# Altium schematic sheet 1.SCHDOC
size A4
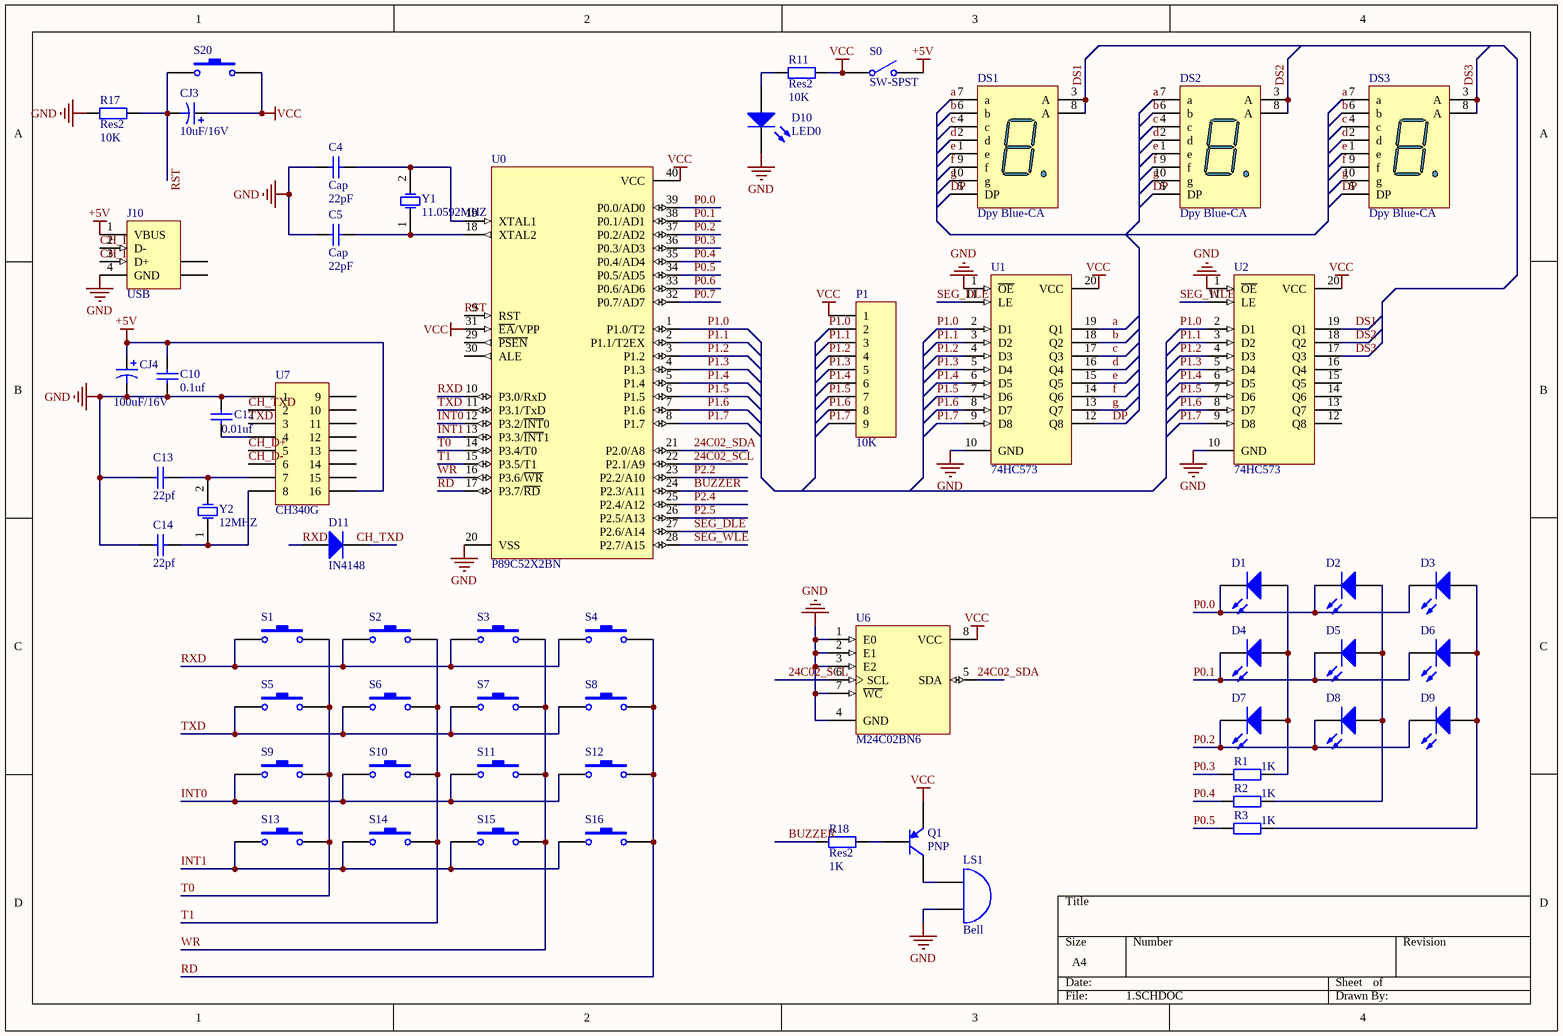
[diagram p0: 1.SCHDOC]

## Parts
C4  Cap  value 22pF  [RAD-0.3]
C5  Cap  value 22pF  [RAD-0.3]
C10  value 0.1uf  [RAD-0.3]  (hidden comment: Cap)
C12  value 0.01uf  [RAD-0.3]  (hidden comment: Cap)
C13  value 22pf  [RAD-0.3]  (hidden comment: Cap)
C14  value 22pf  [RAD-0.3]  (hidden comment: Cap)
CJ3  value 10uF/16V  [RB7.6-15]
CJ4  value 100uF/16V  [RB7.6-15]
D1  (no value)  [LED-0]
D2  (no value)  [LED-0]
D3  (no value)  [LED-0]
D4  (no value)  [LED-0]
D5  (no value)  [LED-0]
D6  (no value)  [LED-0]
D7  (no value)  [LED-0]
D8  (no value)  [LED-0]
D9  (no value)  [LED-0]
D10  LED0  [LED-0]
D11  IN4148  [DO-35]
DS1  Dpy Blue-CA  [H]
DS2  Dpy Blue-CA  [H]
DS3  Dpy Blue-CA  [H]
J10  USB  [787616]
LS1  Bell  [PIN2]
P1  10K  [MHDR1X9]
Q1  PNP  [SOT-23B]
R1  value 1K  [AXIAL-0.4]
R2  value 1K  [AXIAL-0.4]
R3  value 1K  [AXIAL-0.4]
R11  Res2  value 10K  [AXIAL-0.4]
R17  Res2  value 10K  [AXIAL-0.4]
R18  Res2  value 1K  [AXIAL-0.4]
S0  SW-SPST  [SPST-2]
S1  (no value)  [SPST-2]
S2  (no value)  [SPST-2]
S3  (no value)  [SPST-2]
S4  (no value)  [SPST-2]
S5  (no value)  [SPST-2]
S6  (no value)  [SPST-2]
S7  (no value)  [SPST-2]
S8  (no value)  [SPST-2]
S9  (no value)  [SPST-2]
S10  (no value)  [SPST-2]
S11  (no value)  [SPST-2]
S12  (no value)  [SPST-2]
S13  (no value)  [SPST-2]
S14  (no value)  [SPST-2]
S15  (no value)  [SPST-2]
S16  (no value)  [SPST-2]
S20  (no value)  [SPST-2]
U0  P89C52X2BN  [SOT129-1]
U1  74HC573  [FK020]
U2  74HC573  [FK020]
U6  M24C02BN6  [PSDIP8A]
U7  CH340G  [HDR2X8_CEN]
Y1  11.0592MHZ  [R38]
Y2  12MHZ  [R38]

## Nets
+5V: C10.1 CJ4.1 J10.1(VBUS) S0.2(NO) U7.16
GND: C4.1 C5.1 C10.2 C12.2 C13.2 C14.2 CJ4.2 D10.2(K) J10.4(GND) LS1.2(B) R17.1 U0.20(VSS) U1.1(~{OE}) U1.10(GND) U2.1(~{OE}) U2.10(GND) U6.1(E0) U6.2(E1) U6.3(E2) U6.4(GND) U6.7(~{WC}) U7.1
VCC: CJ3.1 P1.1 Q1.3(E) R11.1 S0.1(COMMON) S20.2 U0.31(~{EA}/VPP) U0.40(VCC) U1.20(VCC) U2.20(VCC) U6.8(VCC)
24C02_SCL: U0.22(P2.1/A9) U6.6(SCL)
24C02_SDA: U0.21(P2.0/A8) U6.5(SDA)
a: DS1.7(a) DS2.7(a) DS3.7(a) U1.19(Q1)
b: DS1.6(b) DS2.6(b) DS3.6(b) U1.18(Q2)
BUZZER: R18.2 U0.24(P2.3/A11)
c: DS1.4(c) DS2.4(c) DS3.4(c) U1.17(Q3)
CH_D+: J10.3(D+) U7.5
CH_D-: J10.2(D-) U7.6
CH_TXD: U7.2
d: DS1.2(d) DS2.2(d) DS3.2(d) U1.16(Q4)
DP: DS1.5(DP) DS2.5(DP) DS3.5(DP) U1.12(Q8)
DS1: DS1.3(A) DS1.8(A) U2.19(Q1)
DS2: DS2.3(A) DS2.8(A) U2.18(Q2)
DS3: DS3.3(A) DS3.8(A) U2.17(Q3)
e: DS1.1(e) DS2.1(e) DS3.1(e) U1.15(Q5)
f: DS1.9(f) DS2.9(f) DS3.9(f) U1.14(Q6)
g: DS1.10(g) DS2.10(g) DS3.10(g) U1.13(Q7)
INT0: S9.1 S10.1 S11.1 S12.1 U0.12(P3.2/~{INT}0)
INT1: S13.1 S14.1 S15.1 S16.1 U0.13(P3.3/~{INT}1)
P0.0: D1.2(K) D2.2(K) D3.2(K) U0.39(P0.0/AD0)
P0.1: D4.2(K) D5.2(K) D6.2(K) U0.38(P0.1/AD1)
P0.2: D7.2(K) D8.2(K) D9.2(K) U0.37(P0.2/AD2)
P0.3: R1.2 U0.36(P0.3/AD3)
P0.4: R2.2 U0.35(P0.4/AD4)
P0.5: R3.2 U0.34(P0.5/AD5)
P0.6: U0.33(P0.6/AD6)
P0.7: U0.32(P0.7/AD7)
P1.0: P1.2 U0.1(P1.0/T2) U1.2(D1) U2.2(D1)
P1.1: P1.3 U0.2(P1.1/T2EX) U1.3(D2) U2.3(D2)
P1.2: P1.4 U0.3(P1.2) U1.4(D3) U2.4(D3)
P1.3: P1.5 U0.4(P1.3) U1.5(D4) U2.5(D4)
P1.4: P1.6 U0.5(P1.4) U1.6(D5) U2.6(D5)
P1.5: P1.7 U0.6(P1.5) U1.7(D6) U2.7(D6)
P1.6: P1.8 U0.7(P1.6) U1.8(D7) U2.8(D7)
P1.7: P1.9 U0.8(P1.7) U1.9(D8) U2.9(D8)
P2.2: U0.23(P2.2/A10)
P2.4: U0.25(P2.4/A12)
P2.5: U0.26(P2.5/A13)
RD: S4.2 S8.2 S12.2 S16.2 U0.17(P3.7/~{RD})
RST: CJ3.2 R17.2 S20.1 U0.9(RST)
RXD: D11.1(A) S1.1 S2.1 S3.1 S4.1 U0.10(P3.0/RxD)
SEG_DLE: U0.27(P2.6/A14) U1.11(LE)
SEG_WLE: U0.28(P2.7/A15) U2.11(LE)
T0: S1.2 S5.2 S9.2 S13.2 U0.14(P3.4/T0)
T1: S2.2 S6.2 S10.2 S14.2 U0.15(P3.5/T1)
TXD: S5.1 S6.1 S7.1 S8.1 U0.11(P3.1/TxD) U7.3
WR: S3.2 S7.2 S11.2 S15.2 U0.16(P3.6/~{WR})
NetC4_2: C4.2 U0.19(XTAL1) Y1.2(OSC2)
NetC5_2: C5.2 U0.18(XTAL2) Y1.1(OSC1)
NetC12_1: C12.1 U7.4
NetC13_1: C13.1 U7.7 Y2.2(OSC2)
NetC14_1: C14.1 U7.8 Y2.1(OSC1)
NetD1_1: D1.1(A) D4.1(A) D7.1(A) R1.1
NetD2_1: D2.1(A) D5.1(A) D8.1(A) R2.1
NetD3_1: D3.1(A) D6.1(A) D9.1(A) R3.1
NetD10_1: D10.1(A) R11.2
NetLS1_1: LS1.1(A) Q1.1(C)
NetQ1_2: Q1.2(B) R18.1

Not connected (* = marked no-connect by the designer): D11 2(K); J10 5(SHLD) 6(SHLD); U0 29(~{PSEN}) 30(ALE); U2 12(Q8) 13(Q7) 14(Q6) 15(Q5) 16(Q4); U7 9 10 11 12 13 14 15

## Notes on the sheet
- Labels drawn without touching a wire or pin: CH_TXD

## Library data of the parts
C4 C5 C10 C12-C14 = Cap: Capacitor; Published: 8-Jun-2000; LatestRevisionDate: 17-Jul-2002; LatestRevisionNote: Re-released for DXP Platform.; PackageReference: RAD-0.3; Publisher: Altium Limited
CJ3 CJ4 = Cap Pol1: Polarized Capacitor (Radial); Published: 8-Jun-2000; LatestRevisionDate: 17-Jul-2002; LatestRevisionNote: Re-released for DXP Platform.; PackageReference: RB7.6-15; Publisher: Altium Limited
D1-D10 = LED0: Typical INFRARED GaAs LED; Published: 8-Jun-2000; LatestRevisionDate: 08-Jul-2005; LatestRevisionNote: Mech Layer 1 removed.; PackageReference: LED-0; Publisher: Altium Limited
D11 = Diode 1N914: High Conductance Fast Diode; Published: 8-Jun-2000; LatestRevisionDate: 17-Jul-2002; LatestRevisionNote: Re-released for DXP Platform.; DatasheetDocument: 1997; PackageReference: DO-35; Publisher: Altium Limited; Code_JEDEC: DO-204-AH; ComponentLink1Description: Manufacturer Link; ComponentLink1URL: http://www.fairchildsemi.com/; ComponentLink2Description: Datasheet; ComponentLink2URL: http://www.fairchildsemi.com/ds/1N%2F1N4448.pdf
DS1-DS3 = Dpy Blue-CA: 14.2 mm General Purpose Blue 7-Segment Display: CA, RH DP, Gray Surface; MinimumIntensity: 2020 ucd; Note: IF = 10 mA; Published: 8-Jun-2000; LatestRevisionDate: 17-Dec-2003; LatestRevisionNote: Schematic revised, PCB Footprint replaced.; DatasheetDocument: 24-Sep-2002; PackageDocument: 24-Sep-2002; PackageReference: H; Publisher: Altium Limited; Colour: Blue; ComponentLink1Description: Manufacturer Link; ComponentLink1URL: http://www.agilent.com/
J10 = 787616-5: USB 1.1, Right Angle, Thru-Hole, A Type, Receptacle, 4 Position, Natural; ContactMaterial: Copper Alloy; ContactPlating: Gold Flash over Palladium Nickel or Gold (30) over Nickel; TerminationLength: 2.84mm [0.112in.]; PCB_Layout: Complies with manufacturer's recommendation.; DrillSize: Corresponds to nominal value.; PanelGround: Without; Published: 15-Jul-2004; DatasheetDocument: 11-Jan-2004; PackageDocument: 11-Jan-2004; PackageReference: 787616; Publisher: Altium Limited; HousingMaterial: Thermoplastic; ComponentLink1Description: Manufacturer Link; ComponentLink1URL: http://www.tycoelectronics.com/; ComponentLink2Description: Packaging Specification; ComponentLink2URL: http://ecommas.tycoelectronics.com/commerce/DocumentDelivery/DDEController?Action=showdoc&DocId=Customer+Drawing%7F787616%7FK%7Fpdf%7FEnglish%7FENG_CD_787616_K.pdf
LS1 = Bell: Electrical Bell; Published: 24-Mar-1999; LatestRevisionDate: 17-Jul-2002; LatestRevisionNote: Re-released for DXP Platform.; PackageReference: PIN2; Publisher: Altium Limited
P1 = MHDR1X9: Header, 9-Pin; LatestRevisionDate: 17-Jul-2002; LatestRevisionNote: Re-released for DXP Platform.; Publisher: Altium Limited
Q1 = PNP: PNP Bipolar Transistor; Published: 8-Jun-2000; LatestRevisionDate: 17-Jul-2002; LatestRevisionNote: Re-released for DXP Platform.; PackageReference: SOT-23B; Publisher: Altium Limited; Code_JEDEC: SOT-23
R1-R3 R11 R17 R18 = Res2: Resistor; Published: 8-Jun-2000; LatestRevisionDate: 17-Jul-2002; LatestRevisionNote: Re-released for DXP Platform.; PackageReference: AXIAL-0.4; Publisher: Altium Limited
S0 = SW-SPST: Single-Pole, Single-Throw Switch; Published: 24-Mar-1999; LatestRevisionDate: 17-Jul-2002; LatestRevisionNote: Re-released for DXP Platform.; PackageReference: SPST-2; Publisher: Altium Limited
S1-S16 S20 = SW-PB: Switch; Published: 24-Mar-1999; LatestRevisionDate: 17-Jul-2002; LatestRevisionNote: Re-released for DXP Platform.; PackageReference: SPST-2; Publisher: Altium Limited
U0 = P89C52X2BN: 80C51 8-Bit Flash Microcontroller Family, 8 kB Flash; Published: 21-May-2003; DatasheetVersion: 5-Jun-2002; PackageVersion: Aug-2000; PackageReference: SOT129-1; Publisher: Altium Limited; PackageDescription: DIP, Plastic; 40 Leads; Row Spacing 15.24 mm; Pitch 2.54 mm; Code_JEDEC: MO-015; ComponentLink1Description: Manufacturer Link; ComponentLink1URL: http://www-us2.semiconductors.philips.com/; ComponentLink2Description: Datasheet; ComponentLink2URL: http://www.semiconductors.philips.com/acrobat/datasheets/P89C5XX2_2.pdf
U1 U2 = SNJ54AHC573FK: Octal Transparent D-Type Latch with 3-State Outputs; Published: 8-Jun-2000; LatestRevisionDate: 17-Jul-2002; LatestRevisionNote: Re-released for DXP Platform.; DatasheetVersion: Jul-1998; PackageVersion: 1998; PackageReference: FK020; Publisher: Altium Limited; PackageDescription: Leadless Chip Carrier; 20 Terminals; Body 8.9 x 8.9 mm; ComponentLink1Description: Manufacturer Link; ComponentLink1URL: http://www.ti.com/; ComponentLink2Description: Datasheet; ComponentLink2URL: http://www-s.ti.com/sc/ds/sn74ahc573.pdf
U6 = M24C02BN6: 2Kbit Serial I²C Bus EEPROM; Published: 24-Aug-2001; LatestRevisionDate: 06-Jun-2005; LatestRevisionNote: Stylized 3D Model Added.; DatasheetVersion: Sep-1999; PackageVersion: Jun-1998; PackageReference: PSDIP8A; Publisher: Altium Limited; PackageDescription: DIP; 8 Leads; Row Spacing 7.62 mm; Pitch 2.54 mm; ComponentLink1Description: Manufacturer Link; ComponentLink1URL: http://www.st.com/; ComponentLink2Description: Datasheet; ComponentLink2URL: http://www.st.com/stonline/products/literature/ds/5067/m24c01-r.pdf
U7 = Header 8X2A: Header, 8-Pin, Dual row; LatestRevisionDate: 17-Jul-2002; LatestRevisionNote: Re-released for DXP Platform.; Publisher: Altium Limited
Y1 Y2 = XTAL: Crystal Oscillator; Published: 8-Jun-2000; LatestRevisionDate: 17-Jul-2002; LatestRevisionNote: Re-released for DXP Platform.; PackageReference: R38; Publisher: Altium Limited